# EAGLE design raspi (EAGLE 6.3)
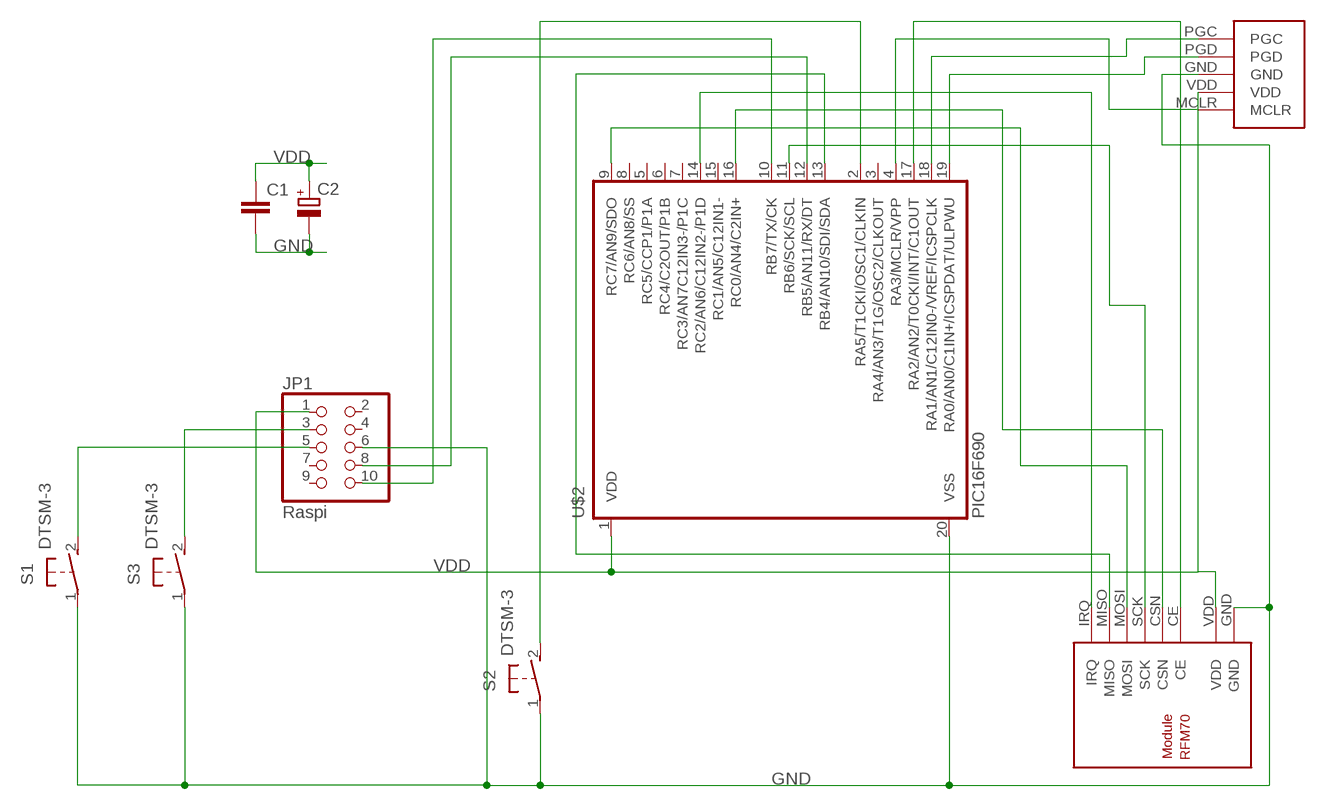
[diagram p0: schematic, sheet 1]

## Parts
C1  C-EUC0805  [C0805]
C2  CPOL-EUSMCA  [SMC_A]
JP1  Raspi  PINHD-2X5  [2X05]
S1  DTSM-3  [DTSM-3]
S2  DTSM-3  [DTSM-3]
S3  DTSM-3  [DTSM-3]
U$1  RFM70  [RFM70]
U$2  PIC16F690  [SSOP20]
U$3  PROGRAMMINGHEADERDIP  [PROGHEADER]

## Nets
GND: C1.2 C2.- JP1.6 S1.1 S2.1 S3.1 U$1.GND U$2.20(VSS) U$3.GND
N$1: JP1.3 S3.2
N$2: JP1.5 S1.2
N$12: U$1.MISO U$2.13(RB4/AN10/SDI/SDA)
N$16: U$1.CE U$2.17(RA2/AN2/T0CKI/INT/C1OUT)
N$18: U$2.19(RA0/AN0/C1IN+/ICSPDAT/ULPWU) U$3.PGD
N$19: U$2.18(RA1/AN1/C12IN0-/VREF/ICSPCLK) U$3.PGC
N$20: U$1.CSN U$2.16(RC0/AN4/C2IN+)
N$21: U$1.IRQ U$2.14(RC2/AN6/C12IN2-/P1D)
N$22: U$1.SCK U$2.11(RB6/SCK/SCL)
N$23: U$1.MOSI U$2.9(RC7/AN9/SDO)
N$25: U$2.4(RA3/MCLR/VPP) U$3.MCLR
N$28: S2.2 U$2.2(RA5/T1CKI/OSC1/CLKIN)
N$33: JP1.10 U$2.10(RB7/TX/CK)
N$34: JP1.8 U$2.12(RB5/AN11/RX/DT)
VDD: C1.1 C2.+ JP1.1 U$1.VDD U$2.1(VDD) U$3.VDD
Unconnected: JP1.2 JP1.4 JP1.7 JP1.9 U$2.3(RA4/AN3/T1G/OSC2/CLKOUT) U$2.5(RC5/CCP1/P1A) U$2.6(RC4/C2OUT/P1B) U$2.7(RC3/AN7C12IN3-/P1C) U$2.8(RC6/AN8/SS) U$2.15(RC1/AN5/C12IN1-)

## Library data of the parts
C1 = rcl:C-EU: CAPACITOR, European symbol
C2 = resistor:CPOL-EU: POLARIZED CAPACITOR, European symbol
JP1 = pinhead:PINHD-2X5: PIN HEADER
S1-S3 = switch-tact:DTSM-3
U$1 = rfm70:RFM70: RFM70 2.4 Ghz Funkmodul Autor: Daniel Weber Website: http://projects.web4clans.com Email: daniel.weber@web4clans.com
U$2 = microchip:PIC16F690*: MICROCONTROLLER PIC16F690 18 I/O One 16-bit timer Two 8-bit timer Two comparators Precision internal oscillator-software selectable 8 MHz - 32 KHz SSP w/ I2C Compatible Address mask option EUSART LIN 2.0 Compatible ECCP+ w/ PWM Steering 12 A/D Channels ULPW Enhanced Low Power Timer 1 Timer 1 Gate Synch Latch 4k Program Flash memory 256 bytes SRAM 256 bytes EEPROM
U$3 = rfm70:PROGRAMMINGHEADER

## Board
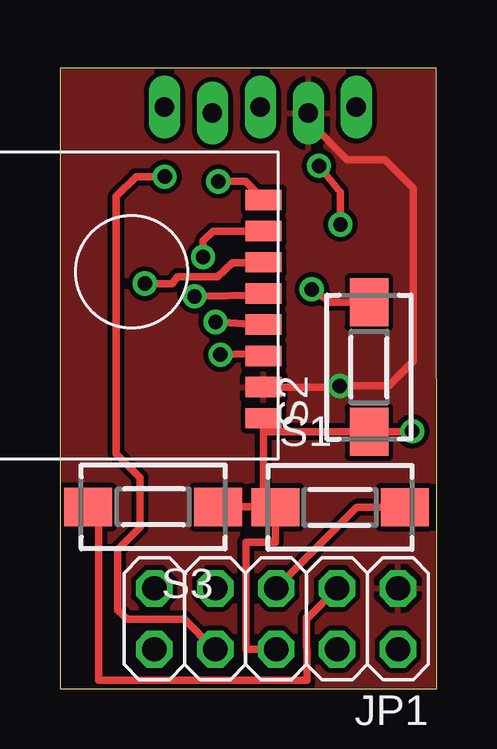
[diagram p1: board, top side]
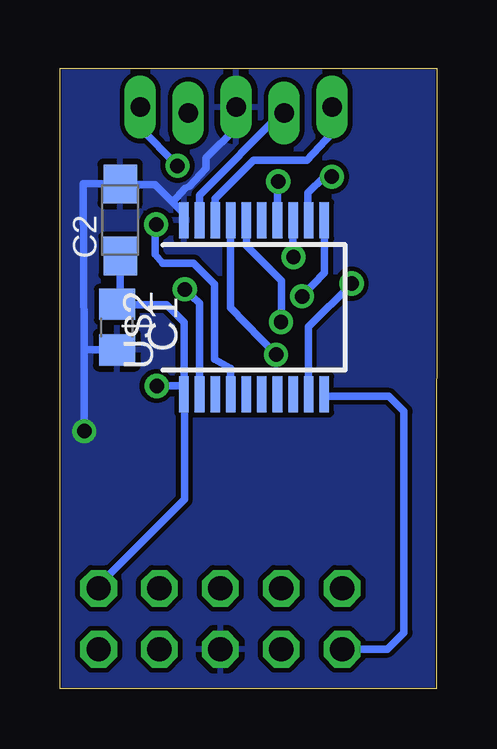
[diagram p2: board, bottom side, seen from below]

Size 15.71 x 25.86 mm. Coordinates in mm from the lower left corner, seen from the top.
Outline: 0.01,0 15.71,0 15.7,25.86 0,25.85 0.01,0
Copper layers (1*16): Top 0.035mm / dielectric 1.5mm / Bottom 0.035mm
Design rules "default *": minimum track width 10mil, minimum drill 24mil, track to track 8mil, track to pad 8mil, pad to pad 8mil, via to via 8mil, smd to smd 8mil, copper to edge 2mil, drill to drill 8mil, minimum pad ring 10mil, minimum via ring 8mil, stop-mask expansion 4mil, vias tented up to drill 0mil, thermal gap 10mil

### Footprints (pad centres in the part's own frame; a part is rotated, then mirrored left to right if it is on the bottom)
C0805 = smd 1.3 x 1.5: 1 -0.95,0; 2 0.95,0
SMC_A = smd 1.6 x 1.4: + -1.5,0; - 1.5,0
2X05 = drill 1.016 octagon: 1 -5.08,-1.27; 2 -5.08,1.27; 3 -2.54,-1.27; 4 -2.54,1.27; 5 0,-1.27; 6 0,1.27; 7 2.54,-1.27; 8 2.54,1.27; 9 5.08,-1.27; 10 5.08,1.27
DTSM-3 = smd 2 x 1.6: 1 -2.7,0; 2 2.7,0
RFM70 = smd 0.85 x 1.5: CE 2.5,-14.3; CSN 3.8,-14.3; GND -0.1,-14.3; IRQ 9,-14.3; MISO 7.7,-14.3; MOSI 6.4,-14.3; SCK 5.1,-14.3; VDD 1.2,-14.3
SSOP20 = smd 0.4 x 1.5: 1 -2.925,-3.625; 2 -2.275,-3.625; 3 -1.625,-3.625; 4 -0.975,-3.625; 5 -0.325,-3.625; 6 0.325,-3.625; 7 0.975,-3.625; 8 1.625,-3.625; 9 2.275,-3.625; 10 2.925,-3.625; 11 2.925,3.625; 12 2.275,3.625; 13 1.625,3.625; 14 0.975,3.625; 15 0.325,3.625; 16 -0.325,3.625; 17 -0.975,3.625; 18 -1.625,3.625; 19 -2.275,3.625; 20 -2.925,3.625
PROGHEADER = drill 0.8 long: GND 0,0; MCLR -4,0; PGC 4,0; PGD 2,0.25; VDD -2,0.25

### Placement (x,y rotation side)
C1  13.34,15.06 270 bottom
C2  13.2,19.53 90 bottom
JP1  9.02,2.91 180 top
S1  11.68,7.56 0 top
S2  12.89,13.4 90 top
S3  3.89,7.57 180 top
U$1  -5.8,11.37 90 top
U$2  7.61,15.89 0 bottom
U$3  8.36,24.23 180 top

### Tracks (layer width: path | path; a pad name or v marks a point on that pad's centre or on a via)
GND  (via drill 0.6)
  Top 0.305: S3.1 8.5,7.57 | JP1.6 7.76,1.64 7.76,6.11 8.98,6.11 S1.1 8.5,7.57 | 8.5,7.57 U$1.GND 8.5,10.7 S2.1 14.69,10.7 v14.69,10.73
  Bottom 0.305: v14.69,10.73 14.69,14.12 | 14.69,14.12 13.33,14.12 C1.2 | C2.- 14.74,21.03 14.69,14.12 | U$2.20 10.52,19.51 10.52,19.77 11.02,20.28 | 13.2,21.51 C2.- | 8.38,24.23 U$3.GND 8.36,23.36 9.63,22.12 9.63,21.69 10.3,20.94 10.49,20.84 11.02,20.28 | 11.02,20.28 11.75,21.01 13.17,21.01 C2.-
  pour Bottom: 0.14,25.69 0.17,0.14 15.6,0.14 15.56,25.74
N$1
  Top 0.305: S3.2 1.61,7.57 1.61,0.36 10.3,0.36 10.29,2.98 10.36,2.98 JP1.3
N$2
  Top 0.305: S1.2 12.39,7.56 JP1.5
N$12  (via drill 0.6)
  Top 0.305: v5.97,17.98 5.97,18.66 6.38,19.06 U$1.MISO
  Bottom 0.305: U$2.13 5.99,18 v5.97,17.98
N$16  (via drill 0.6)
  Top 0.305: v6.69,13.92 8.38,13.98 U$1.CE
  Bottom 0.305: U$2.17 8.59,15.88 v6.69,13.92
N$18
  Bottom 0.305: U$3.PGD 6.49,23.98 9.88,20.56 U$2.19
N$19
  Bottom 0.305: U$3.PGC 4.36,23.15 5.41,22.02 7.63,22.02 9.25,20.41 9.25,19.59 U$2.18
N$20  (via drill 0.6)
  Top 0.305: v6.49,15.28 8.51,15.15 U$1.CSN
  Bottom 0.305: U$2.16 7.94,18.46 6.48,17 6.48,15.34 v6.49,15.28
N$21  (via drill 0.6)
  Top 0.305: v6.6,21.13 7.73,21.13 U$1.IRQ
  Bottom 0.305: U$2.14 6.64,21.1 v6.6,21.13
N$22  (via drill 0.6)
  Top 0.305: v5.61,16.34 8.43,16.4 U$1.SCK
  Bottom 0.305: U$2.11 4.69,17.32 v5.61,16.34
N$23  (via drill 0.6)
  Top 0.305: v3.54,16.88 4.67,16.88 4.91,17.17 6.57,17.17 7.2,17.75 8.48,17.75 U$1.MOSI
  Bottom 0.305: U$2.9 5.34,15.09 v3.54,16.88
N$25  (via drill 0.6)
  Top 0.305: v11.7,19.34 11.7,20.69 v10.81,21.78
  Bottom 0.305: U$2.4 8.59,13.35 9.26,13.73 9.26,16.85 10.13,17.73 11.43,17.73 11.75,18.1 11.75,19.29 v11.7,19.34 | v10.81,21.78 10.85,21.82 12.36,23.39 12.36,24.19 U$3.MCLR
N$28  (via drill 0.6)
  Top 0.305: S2.2 11.3,16.1 v10.5,16.64
  Bottom 0.305: v10.5,16.64 9.88,16.07 U$2.2
N$33
  Bottom 0.305: JP1.10 2.05,1.64 1.36,2.34 1.36,11.56 1.98,12.18 4.6,12.18 U$2.10
N$34  (via drill 0.6)
  Top 0.305: JP1.8 6.42,1.64 5.21,2.9 2.82,2.9 2.4,3.28 2.4,5.78 3.34,6.72 3.34,8.79 2.35,9.78 2.35,20.51 3.17,21.34 v4.37,21.34
  Bottom 0.305: v4.37,21.34 4.69,21.34 5.36,20.66 5.36,19.54 U$2.12
VDD  (via drill 0.6)
  Top 0.305: U$3.VDD 10.36,23.67 11.98,22.05 13.55,22.05 14.74,20.85 14.74,13.64 13.72,12.61 v11.67,12.61 11.67,12.57 U$1.VDD
  Bottom 0.305: JP1.1 14.1,4.3 10.52,7.89 10.52,12.24 U$2.1 | U$2.1 10.54,15.26 11.26,15.99 13.31,15.99 C1.1 13.2,16.15 C2.+ | v11.67,12.61 10.54,12.61 U$2.1
  pour Top: 0.14,25.72 15.53,25.74 15.6,0.13 0.15,0.13